# EAGLE design mosquino-power-stepup (EAGLE 5.06)
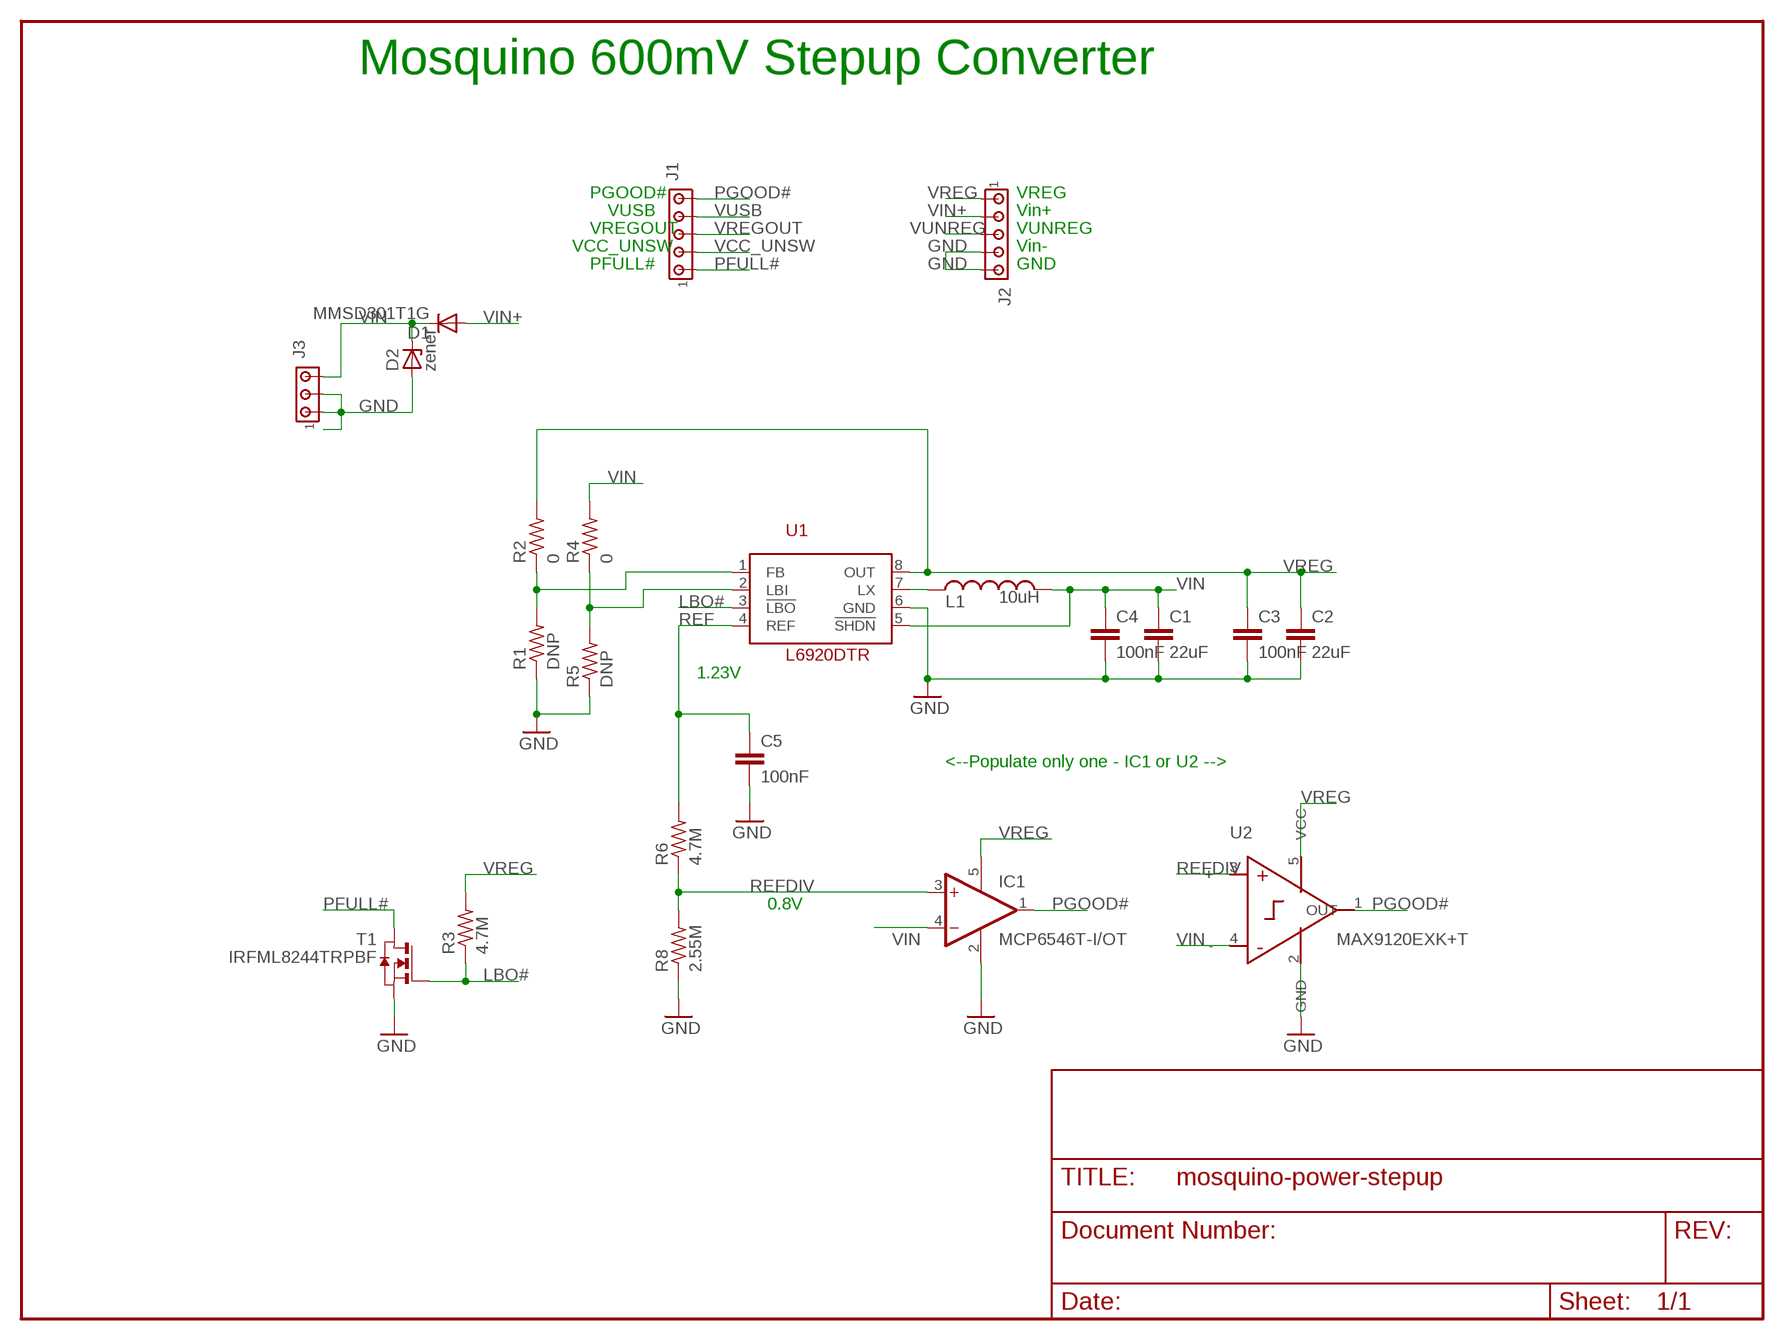
[diagram p0: schematic, sheet 1]

## Parts
C1  22uF  C-EUC1206  [C1206]
C2  22uF  C-EUC1206  [C1206]
C3  100nF  C-EUC0805  [C0805]
C4  100nF  C-EUC0805  [C0805]
C5  100nF  C-EUC0805  [C0805]
D1  MMSD301T1G  DIODE-SOD123  [SOD123]
D2  zener  ZENER-DIODESOD80C  [SOD80C]
IC1  MCP6546T-I/OT  OPA344N-SOT23  [SOT23-5]
J1  MTA05-100  [10X05MTA]
J2  MTA05-100  [10X05MTA]
J3  MTA03-100  [10X03MTA]
L1  10uH  SDR0604  [SDR0604]
R1  DNP  R-US_R0805  [R0805]
R2  0  R-US_R0805  [R0805]
R3  4.7M  R-US_R0805  [R0805]
R4  0  R-US_R0805  [R0805]
R5  DNP  R-US_R0805  [R0805]
R6  4.7M  R-US_R0805  [R0805]
R8  2.55M  R-US_R0805  [R0805]
T1  IRFML8244TRPBF  NMOSSOT23  [SOT-23]
U1  L6920DTR  L6920  [TSSOP8]
U2  MAX9120EXK+T  MAX9117  [SC70-5]

## Nets
GND [pwr]: C1.2 C2.2 C3.2 C4.2 C5.2 D2.A IC1.2(V-) J2.4 J2.5 J3.1 J3.2 R1.1 R5.1 R8.1 T1.2(S) U1.6(GND) U2.2(GND)
LBO#: R3.1 T1.3(G) U1.3(!LBO)
N$2: R1.2 R2.1 U1.1(FB)
N$3: R4.1 R5.2 U1.2(LBI)
N$5: L1.1 U1.7(LX)
PFULL#: J1.1 T1.1(D)
PGOOD#: IC1.1(OUT) J1.5 U2.1(OUT)
REF: C5.1 R6.2 U1.4(REF)
REFDIV: IC1.3(+IN) R6.1 R8.2 U2.3(+)
VCC_UNSW: J1.2
VIN: C1.1 C4.1 D1.C D2.C IC1.4(-IN) J3.3 L1.2 R4.2 U1.5(!SHDN) U2.4(-)
VIN+ [pwr]: D1.A J2.2
VREG [pwr]: C2.1 C3.1 IC1.5(V+) J2.1 R2.2 R3.2 U1.8(OUT) U2.5(VCC)
VREGOUT: J1.3
VUNREG: J2.3
VUSB: J1.4

## Notes on the sheet
- Mosquino 600mV Stepup Converter
- PGOOD# | VREG
- VUSB | Vin+
- VREGOUT | VUNREG
- VCC_UNSW | Vin-
- PFULL# | GND
- 1.23V
- <--Populate only one - IC1 or U2 -->
- 0.8V

## Library data of the parts
C1-C5 = rcl:C-EU: CAPACITOR, European symbol
D1 = diode:DIODE-: DIODE
D2 = diode:ZENER-DIODE: Z-Diode
IC1 = linear:OPA*-SOT23: Single Operational Amplifier Low Power, Single-Supply, Rail-To-Rail Operational Amplifier Source: http://focus.ti.com/lit/ds/symlink/opa2345.pdf
J1 J2 = con-amp:MTA05-100: AMP connector
J3 = con-amp:MTA03-100: AMP connector
L1 = mideeval:SDR0604: SDR0604 Series SMD power inductor Bourns JR 2008.11.26
R1-R6 R8 = rcl:R-US_: RESISTOR, American symbol
T1 = zetex:NMOSSOT23: MOS FET
U1 = mideeval:L6920: STMicroelectronics E-L6920 stepup converter. 20060327 / tgipson
U2 = tim:MAX9117: MAX9117 / MAX9118 / MAX9119 / MAX9120 comparators in SC-70. 20110819 / tgipson

## Net classes
0 default: width 0.203 mm
1 pwr: width 0.203 mm, drill 0.381 mm, clearance 0.203 mm
4 digital: width 0.203 mm, drill 0.381 mm, clearance 0.203 mm

## Board
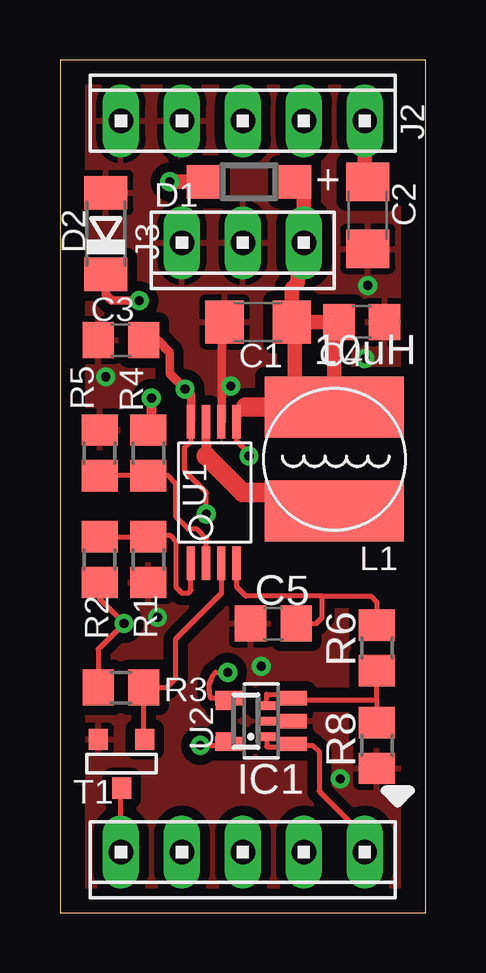
[diagram p1: board, top side]
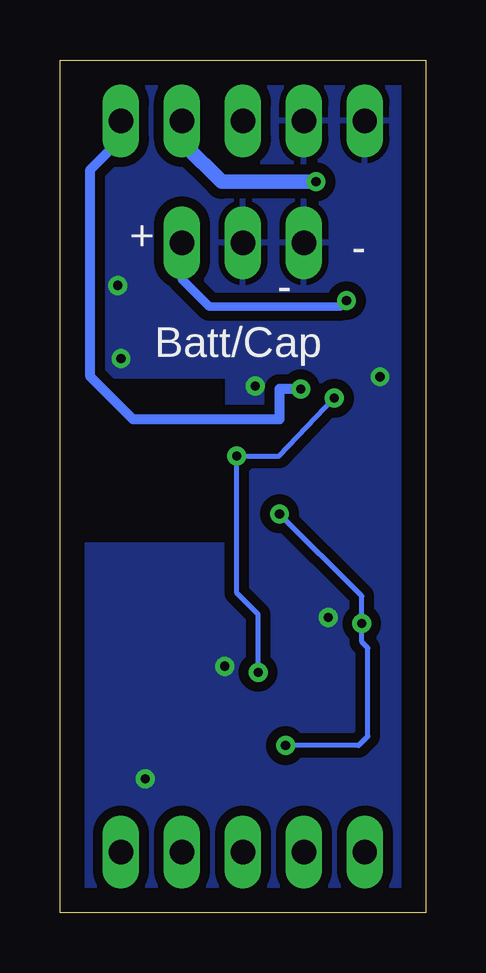
[diagram p2: board, bottom side, seen from below]

Size 15.24 x 35.56 mm. Coordinates in mm from the lower left corner, seen from the top.
Outline: 15.24,35.56 0,35.56 0,0 15.24,0 15.24,35.56
Copper layers (1*16): Top 0.035mm / dielectric 1.5mm / Bottom 0.035mm
Design rules "default": minimum track width 8mil, minimum drill 15mil, track to track 8mil, track to pad 8mil, pad to pad 8mil, via to via 8mil, smd to smd 8mil, copper to edge 40mil, drill to drill 8mil, minimum pad ring 10mil, minimum via ring 8mil, stop-mask expansion 4mil, vias tented up to drill 0mil, thermal gap 10mil

### Footprints (pad centres in the part's own frame; a part is rotated, then mirrored left to right if it is on the bottom)
C1206 = smd 1.6 x 1.8: 1 -1.4,0; 2 1.4,0
C0805 = smd 1.3 x 1.5: 1 -0.95,0; 2 0.95,0
SOD123 = smd 1.4 x 1.4: A 1.9,0; C -1.9,0
SOD80C = smd 1.4 x 1.8: A 1.7,0; C -1.7,0
SOT23-5 = smd 0.6 x 1.2: 1 -0.95,-1.306; 2 0,-1.306; 3 0.95,-1.306; 4 0.95,1.306; 5 -0.95,1.306
10X05MTA = drill 1.016 long: 1 5.08,0; 2 2.54,0; 3 0,0; 4 -2.54,0; 5 -5.08,0
10X03MTA = drill 1.016 long: 1 2.54,0; 2 0,0; 3 -2.54,0
SDR0604 = smd 5.791 x 2.54: 1 0,2.159; 2 0,-2.159
R0805 = smd 1.3 x 1.5: 1 -0.95,0; 2 0.95,0
SOT-23 = smd 0.787 x 0.889: 1 0.025,-1.016; 2 -0.94,1.016; 3 0.991,1.016
TSSOP8 = smd 0.348 x 1.397: 1 -0.901,-2.95; 2 -0.266,-2.95; 3 0.369,-2.95; 4 1.004,-2.95; 5 1.003,2.95; 6 0.368,2.95; 7 -0.267,2.95; 8 -0.902,2.95
SC70-5 = smd 0.35 x 0.8: 1 -0.65,-0.85; 2 0,-0.85; 3 0.65,-0.85; 4 0.65,0.85; 5 -0.65,0.85

### Placement (x,y rotation side)
C1  8.26,24.64 180 top
C2  12.83,29.08 270 top
C3  2.54,23.88 180 top
C4  12.57,24.64 0 top
C5  8.89,12.06 180 top
D1  7.87,30.48 180 top
D2  1.91,28.32 90 top
IC1  8.38,8 90 top
J1  7.62,2.54 180 top
J2  7.62,33.02 0 top
J3  7.62,27.94 180 top
L1  11.43,18.92 180 top
R1  3.68,14.73 90 top
R2  1.65,14.73 270 top
R3  2.54,9.4 180 top
R4  3.68,19.18 90 top
R5  1.65,19.18 270 top
R6  13.21,11.05 90 top
R8  13.21,6.99 90 top
T1  2.54,6.22 0 top
U1  6.35,17.53 0 top
U2  7.75,8 90 top

### Tracks (layer width: path | path; a pad name or v marks a point on that pad's centre or on a via)
GND  (via drill 0.38)
  Top 0.203: U2.2 9.25,8.03 9.65,8.03 IC1.2
  Top 0.356: U1.6 6.73,24.13 6.86,24.25 C1.2
  other vias: 12.7,23.11 12.83,26.16 7.11,21.97 1.91,22.35 4.06,12.32 8.38,10.29 11.68,5.59
  pour Top (isolate 0.406): 15.24,35.56 15.24,0 0,0 0,35.56
  pour Bottom (isolate 0.406): 0,35.56 0,0 15.24,0 15.24,15.37 8.26,15.37 8.26,22.35 15.24,22.35 15.24,35.56
LBO#
  Top 0.203: U1.3 6.73,14.56 6.73,13.34 4.83,11.43 4.83,9.78 4.45,9.4 R3.1 3.49,7.28 T1.3
N$2
  Top 0.203: R2.1 R1.2 3.75,15.75 4.57,15.75 4.83,15.49 4.83,13.59 5.08,13.34 5.33,13.34 5.45,13.45 U1.1
N$3
  Top 0.203: R5.2 R4.1 4.51,18.23 4.83,17.91 4.83,16.51 5.33,16 5.71,16 6.1,15.62 6.1,14.59 U1.2
N$5
  Top 0.356: 6.1,19.56 6.08,19.57 U1.7
  Top 0.406: 6.1,19.56 6.1,19.05
  Top 0.813: L1.1 10.67,17.53 7.62,17.53 6.1,19.05
PFULL#
  Top 0.203: T1.1 2.54,5.18 J1.1
PGOOD#
  Top 0.203: J1.5 12.7,3.17 10.79,5.08 10.79,6.73 10.54,6.99 9.75,6.99 IC1.1 9.65,7.11 9.45,6.93 8.61,6.93 U2.1
REF
  Top 0.203: U1.4 7.37,14.56 7.37,13.59 7.75,13.21 10.92,13.21 | 10.92,13.21 12.95,13.21 13.21,12.95 R6.2 | C5.1 10.67,12.06 10.92,12.32 10.92,13.21
REFDIV
  Top 0.203: 13.21,8.89 R6.1 | 13.21,8.89 R8.2 | 13.21,8.89 9.75,8.89 IC1.3 9.4,9.07 9.2,9.12 8.61,9.12 U2.3
VIN  (via drill 0.38)
  Top 0.203: U1.5 7.37,20.46 7.37,19.68 7.87,19.18 v7.87,19.05 | v6.99,10.03 6.48,10.03 6.36,9.88 6.22,9.53 6.22,9.27 6.29,8.95 IC1.4 7.3,8.95 7.14,8.99 U2.4
  Top 0.356: 7.75,21.08 7.35,20.69 U1.5 | D2.C 1.91,25.78 2.16,25.53 v3.3,25.53 | 3.81,20.25 R4.2
  Top 0.406: L1.2 11.62,21.08 | v3.81,21.46 3.81,20.25
  Top 0.61: C1.1 C4.1 11.43,24.45 L1.2 | C1.1 9.78,24.51 9.78,21.08 | C1.1 9.65,26.04 9.91,26.29 9.91,27.69 J3.3 10.16,30.09 D1.C
  Top 0.813: 7.75,21.08 9.78,21.08 L1.2
  Bottom 0.203: v3.81,21.46 6.1,19.05 v7.87,19.05 7.87,13.34 6.99,12.45 v6.99,10.03
  Bottom 0.356: v3.3,25.53 3.56,25.27 9.02,25.27 10.16,26.42 J3.3
VIN+  (via drill 0.38)
  Top 0.61: v4.57,30.48 D1.A
  Bottom 0.61: J2.2 10.03,32 8.51,30.48 v4.57,30.48
VREG  (via drill 0.38)
  Top 0.203: U1.8 5.46,20.46 5.46,19.68 5.21,19.43 5.21,18.41 6.1,17.53 v6.1,16.64 | R2.2 1.65,13.08 v2.67,12.06 1.59,10.99 R3.2 | v5.84,6.99 7.01,6.99 IC1.5 7.11,7.11 7.32,7.06 7.26,6.93 U2.5 | v5.21,21.84 5.28,21.74 5.3,21.75
  Top 0.356: U1.8 5.46,20.49 5.46,21.59 5.3,21.75 4.57,22.48 4.57,23.37 4.06,23.88 C3.1
  Top 0.61: C2.1 12.7,30.36 J2.1
  Bottom 0.203: v6.1,16.64 2.67,13.21 v2.67,12.06 2.67,11.3 2.41,11.05 2.41,7.37 2.79,6.99 v5.84,6.99
  Bottom 0.356: 12.7,32.26 J2.1
  Bottom 0.406: v5.21,21.84 6.1,21.84 6.1,20.57 12.19,20.57 13.97,22.35 13.97,30.99 12.7,32.26

### Text on the board
tPlace: +
bPlace: - | + | - | Batt/Cap